# EAGLE design VEML6070 (EAGLE 7.4.0)
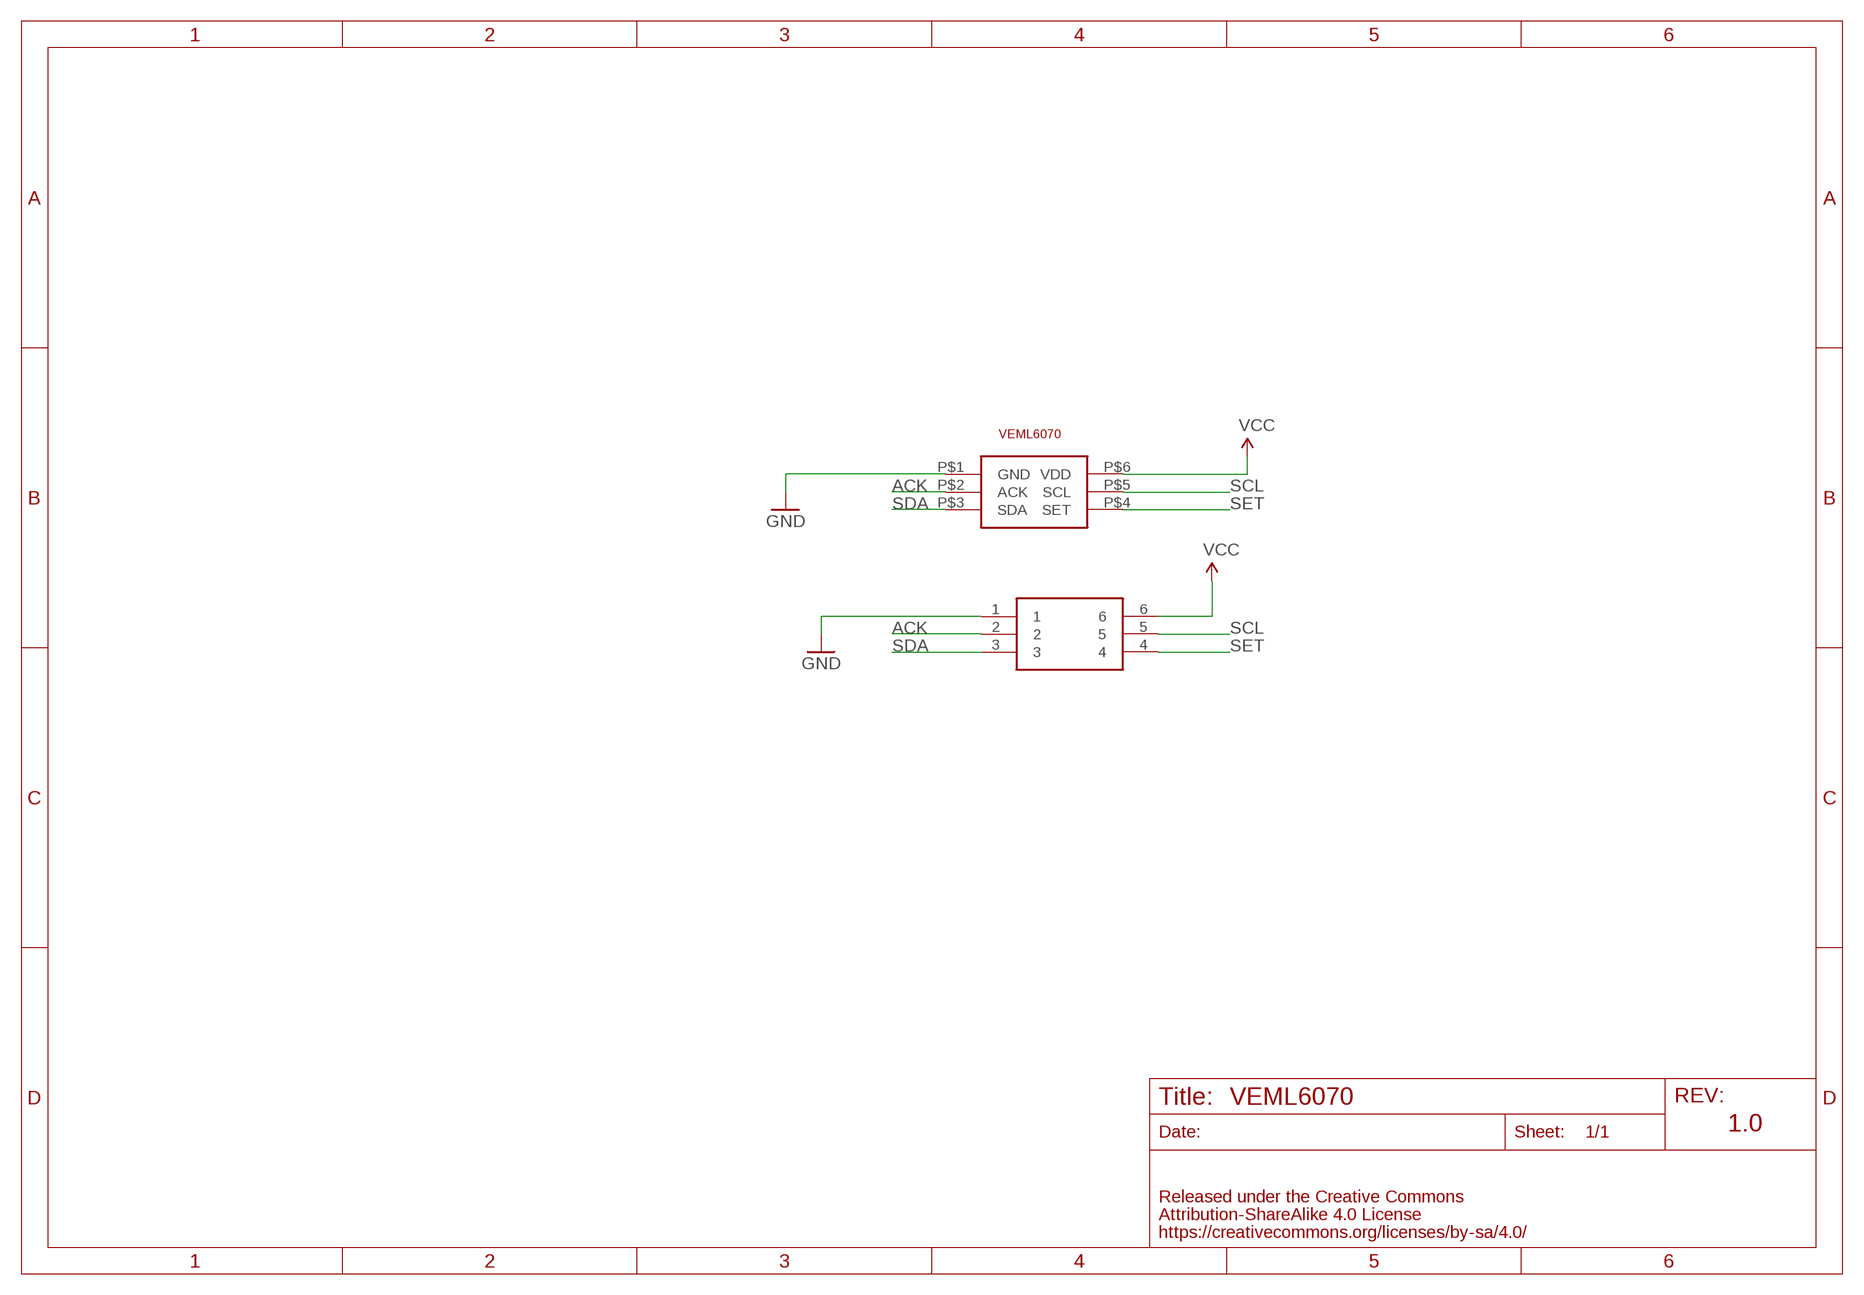
[diagram p0: schematic, sheet 1]

## Parts
U$2  6PIN  [6PIN]
VEML6070  VI-VEML6070  [VISHAY-VEML6070]

## Nets
ACK: U$2.2 VEML6070.P$2(ACK)
GND: U$2.1 VEML6070.P$1(GND)
SCL: U$2.5 VEML6070.P$5(SCL)
SDA: U$2.3 VEML6070.P$3(SDA)
SET: U$2.4 VEML6070.P$4(SET)
VCC: U$2.6 VEML6070.P$6(VDD)

## Notes on the sheet
- 1.0

## Library data of the parts
U$2 = FaBo-Breakout:6PIN
VEML6070 = FaBo-Mems:VI-VEML6070

## Board
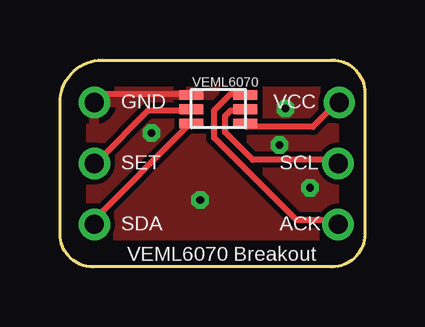
[diagram p1: board, top side]
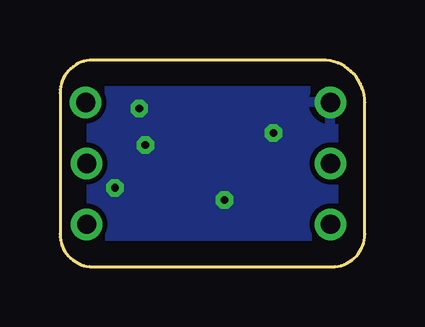
[diagram p2: board, bottom side, seen from below]

Size 12.7 x 8.62 mm. Coordinates in mm from the lower left corner, seen from the top.
Copper layers (1*16): Top 0.035mm / dielectric 1.5mm / Bottom 0.035mm
Design rules "default": minimum track width 10mil, minimum drill 24mil, track to track 8mil, track to pad 8mil, pad to pad 8mil, via to via 8mil, smd to smd 8mil, copper to edge 40mil, drill to drill 8mil, minimum pad ring 10mil, minimum via ring 8mil, stop-mask expansion 4mil, vias tented up to drill 0mil, thermal gap 10mil

### Footprints (pad centres in the part's own frame; a part is rotated, then mirrored left to right if it is on the bottom)
6PIN = drill 0.8: 1 -4.92,2.54; 2 -4.92,0; 3 -4.92,-2.54; 4 5.24,-2.54; 5 5.24,0; 6 5.283,2.54
VISHAY-VEML6070 = smd 1 x 0.4: P$1 -1.125,0.57; P$2 -1.125,-0.03; P$3 -1.125,-0.63; P$4 1.125,0.57; P$5 1.125,-0.03; P$6 1.125,-0.63

### Placement (x,y rotation side)
U$2  6.35,4.31 0 top
VEML6070  6.6,6.6 0 top

### Tracks (layer width: path | path; a pad name or v marks a point on that pad's centre or on a via)
ACK
  Top 0.254: VEML6070.P$2 5.28,6.52 3.68,6.52 1.63,4.46 U$2.2
GND  (via drill 0.32)
  Top 0.254: VEML6070.P$1 5.28,7.21 1.85,7.21 1.63,6.98 U$2.1
  other vias: 3.81,5.58 5.84,2.79 10.41,3.29 9.14,5.07 9.4,6.6
  pour Top: -1.78,-1.02 13.97,-1.02 13.97,9.64 -1.78,9.64 -1.78,-0.77
  pour Bottom: -1.78,-1.02 13.97,-1.02 13.97,9.64 -1.78,9.64
SCL
  Top 0.254: VEML6070.P$5 7.57,6.52 7.11,6.52 6.88,6.29 6.88,5.6 8.03,4.46 11.46,4.46 U$2.5
SDA
  Top 0.254: VEML6070.P$3 5.28,5.83 1.4,1.95 U$2.3
SET
  Top 0.254: VEML6070.P$4 7.57,7.21 7.11,7.21 6.43,6.52 6.43,5.38 9.86,1.95 11.46,1.95 U$2.4
VCC
  Top 0.254: VEML6070.P$6 7.8,5.83 10.54,5.83 11.46,6.75 U$2.6

### Text on the board
tPlace: GND | VCC | SET | SCL | SDA | ACK | VEML6070 Breakout